# EAGLE design arduino-lockitron-nfc (EAGLE 7.5.0)
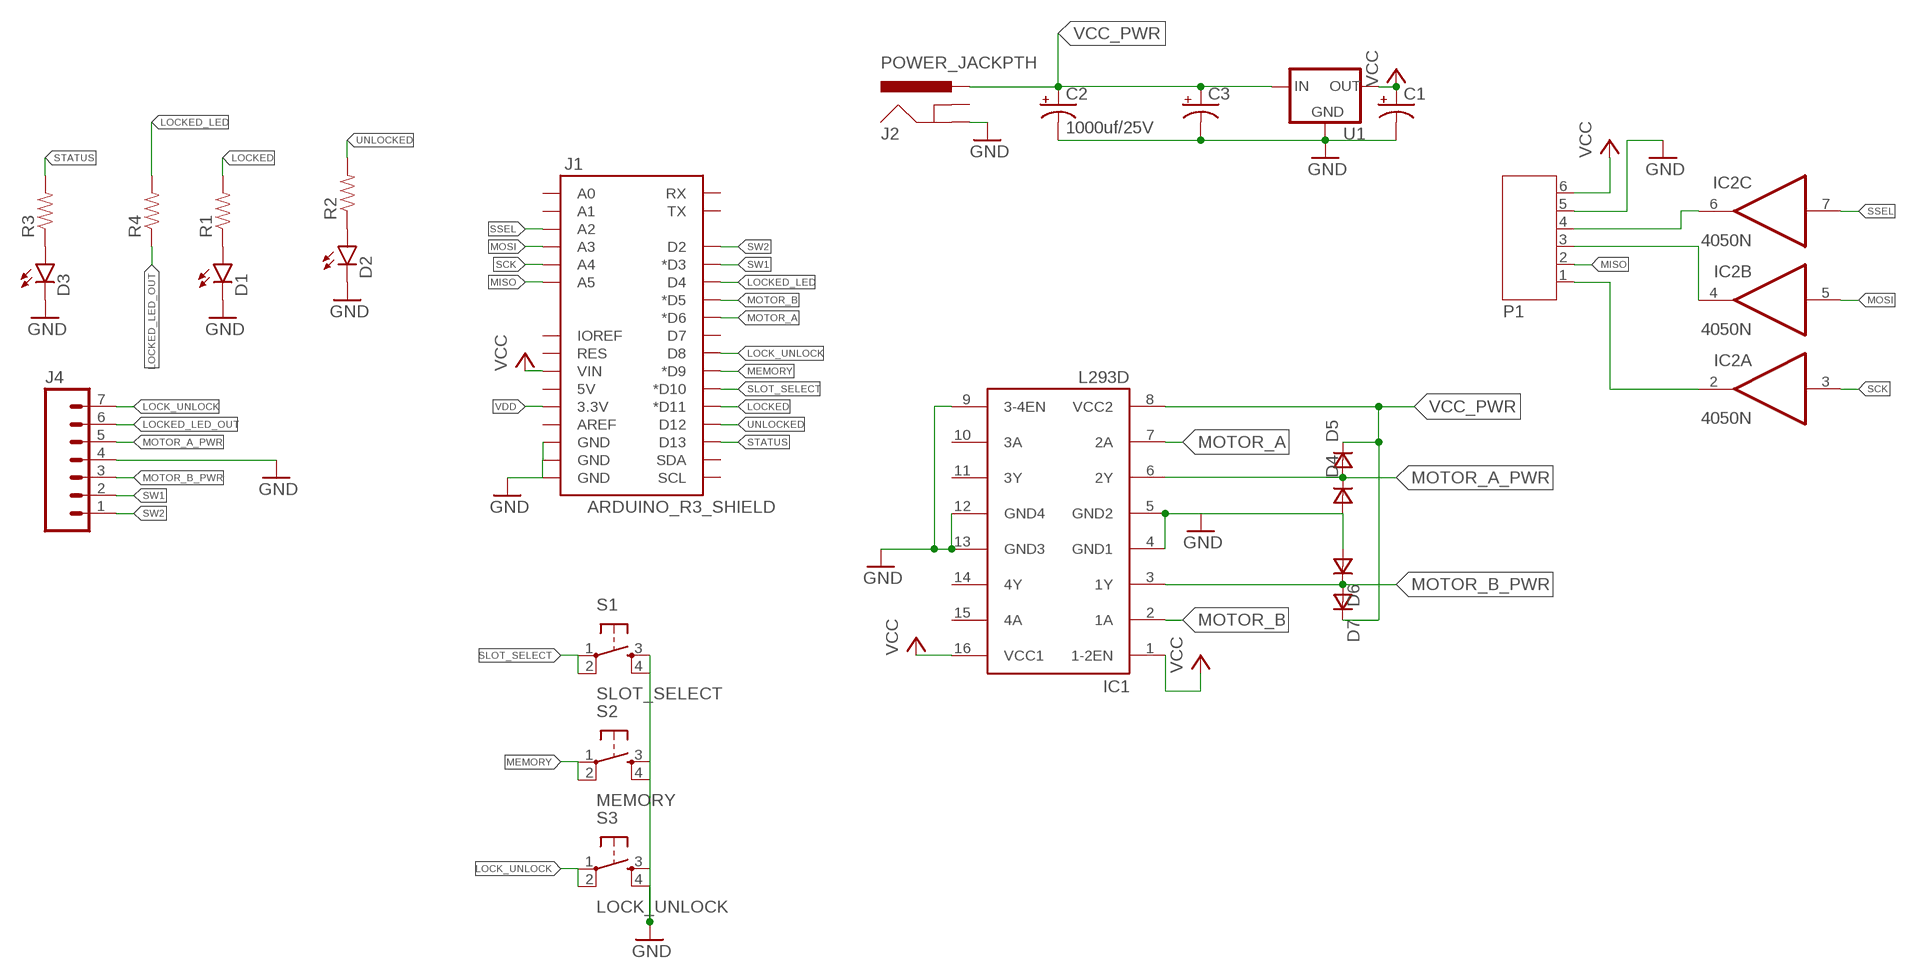
[diagram p0: schematic, sheet 1]

## Parts
C1  47UF-50V-20%(ELECT)  [PANASONIC_D]
C2  1000uf/25V  1000UF-25V(PTH)KIT  [CPOL-RADIAL-1000UF-25V-KIT]
C3  47UF-50V-20%(ELECT)  [PANASONIC_D]
D1  LED0603  [LED-0603]
D2  LED0603  [LED-0603]
D3  LED0603  [LED-0603]
D4  DSOD323  [SOD323]
D5  DSOD323  [SOD323]
D6  DSOD323  [SOD323]
D7  DSOD323  [SOD323]
IC1  L293D  [DIL16]
IC2  4050N  [DIL16]
J1  ARDUINO_R3_SHIELD  [UNO_R3_SHIELD]
J2  POWER_JACKPTH  [POWER_JACK_PTH]
J4  M07LONGPADS  [1X07_LONGPADS]
P1  JST-PH6  [JST-PH6]
R1  RESISTOR0603  [0603-RES]
R2  RESISTOR0603  [0603-RES]
R3  RESISTOR0603  [0603-RES]
R4  RESISTOR0603  [0603-RES]
S1  SLOT_SELECT  TAC_SWITCHSMD  [TACTILE-SWITCH-SMD]
S2  MEMORY  TAC_SWITCHSMD  [TACTILE-SWITCH-SMD]
S3  LOCK_UNLOCK  TAC_SWITCHSMD  [TACTILE-SWITCH-SMD]
U1  V_REG_78XXSIDE  [78XXL]

## Nets
LOCK_UNLOCK: J1.D8 J4.7 S3.1 S3.2
LOCKED: J1.D11(*D11) R1.2
LOCKED_LED: J1.D4 R4.2
LOCKED_LED_OUT: J4.6 R4.1
MEMORY: J1.D9(*D9) S2.1 S2.2
MISO: J1.A5 P1.2
MOSI: IC2.5(B:I) J1.A3
MOTOR_A: IC1.7(2A) J1.D6(*D6)
MOTOR_A_PWR: D4.1(C) D5.2(A) IC1.6(2Y) J4.5
MOTOR_B: IC1.2(1A) J1.D5(*D5)
MOTOR_B_PWR: D6.1(C) D7.2(A) IC1.3(1Y) J4.3
N$1: IC2.2(A:O) P1.1
N$2: IC2.4(B:O) P1.3
N$3: IC2.6(C:O) P1.4
N$4: D1.A R1.1
N$5: D3.A R3.1
N$6: D2.A R2.1
SCK: IC2.3(A:I) J1.A4
SLOT_SELECT: J1.D10(*D10) S1.1 S1.2
SSEL: IC2.7(C:I) J1.A2
STATUS: J1.D13 R3.2
SW1: J1.D3(*D3) J4.2
SW2: J1.D2 J4.1
UNLOCKED: J1.D12 R2.2
VCC: C1.+ IC1.1(1-2EN) IC1.16(VCC1) J1.VIN P1.6 U1.OUT
VCC_PWR: C2.+ C3.+ D5.1(C) D7.1(C) IC1.8(VCC2) J2.PWR U1.IN
VDD: J1.3.3V
VSS: C1.- C2.- C3.- D1.C D2.C D3.C D4.2(A) D6.2(A) IC1.4(GND1) IC1.5(GND2) IC1.9(3-4EN) IC1.12(GND4) IC1.13(GND3) J1.GND@0(GND) J1.GND@1(GND) J1.GND@2(GND) J2.GND J4.4 P1.5 S1.3 S1.4 S2.3 S2.4 S3.3 S3.4 U1.GND ; supply symbol labelled GND
Unconnected: IC1.10(3A) IC1.11(3Y) IC1.14(4Y) IC1.15(4A) IC2.9(D:I) IC2.10(D:O) IC2.11(E:I) IC2.12(E:O) IC2.14(F:I) IC2.15(F:O) J1.5V J1.A0 J1.A1 J1.AREF J1.D7 J1.IOREF J1.RES J1.RX J1.SCL J1.SDA J1.TX J2.GNDBREAK

## Power pins joined to a net without a drawn wire
VDD: IC2.1(P:VDD)
VSS: IC2.8(P:VSS)

## Library data of the parts
C1 C3 = SparkFun-Capacitors:47UF-50V-20%(ELECT): CAP-10547; PROD_ID: CAP-10547
C2 = SparkFun-Capacitors:1000UF-25V(PTH): CAP-08070; PROD_ID: CAP-09538
D1-D3 = SparkFun-LED:LED: LEDs Standard schematic elements and footprints for 5mm, 3mm, 1206, and 0603 sized LEDs. 5mm - Spark Fun Electronics SKU : COM-00529 (and others)
D4-D7 = zetex:D: DIODE; MPN: CDSOD323-T05C; OC_FARNELL: 1824860; OC_NEWARK: 79R6078
IC1 = st-microelectronics:L293D: PUSH-PULL 4 CHANNEL DRIVER; MPN: L293D; OC_FARNELL: 9589619; OC_NEWARK: 56P8249
IC2 = 40xx:4050: Hex non-inverting BUFFER
J1 = SparkFun-Boards:ARDUINO_R3_SHIELD: Shield form compatible with the Arduino Uno R3.
J2 = SparkFun-Connectors:POWER_JACK: Power Jack This is the standard 5.5mm barrel jack for power. The PTH is the most common, proven, reliable, footprint. The Slot footprint only works if the mill layer is transmitted to the PCB fab house so be warned. Mating wall wart : TOL-00298 (and others); PROD_ID: CONN-08197
J4 = SparkFun-Connectors:M07: Header 7 Standard 7-pin 0.1" header. Use with straight break away headers (SKU : PRT-00116), right angle break away headers (PRT-00553), swiss pins (PRT-00743), machine pins (PRT-00117), and female headers (PRT-00115). NOTES ON THE VARIANTS LOCK and LOCK_LONGPADS... This footprint was designed to help hold the alignment of a through-hole component (i.e. 7-pin header) while soldering it into place. You may notice that each hole has been shifted either up or down by 0.005 of an inch from it's more standard position (which is usually a perfectly straight line). This slight alteration caused the pins (the squares in the middle) to touch the edges of the holes. Because they are alternating, it causes a "brace" to hold the header in place. 0.005 has proven to be the perfect amount of "off-center" position when using our standard breakaway headers. Although looks a little odd when you look at the bare footprint, once you have a header in there, the alteration is very hard to notice. Also, if you push a header all the way into place, it is covered up entirely on the bottom side. This idea of altering the position of holes to aid alignment will be further integrated into the Sparkfun Library for other footprints. It can help hold any component with 3 or more connection pins.
P1 = jst-ph:JST-PH6
R1-R4 = SparkFun-Resistors:RESISTOR: Resistor Basic schematic elements and footprints for 0603, 1206, and PTH resistors.
S1-S3 = SparkFun-Retired:TAC_SWITCH: Momentary Switch Button commonly used for reset or general input. Spark Fun Electronics SKU : COM-00097 SMT- SWCH-08247; PROD_ID: SWCH-08247; VALUE: TAC_SWITCHSMD
U1 = SparkFun-PowerIC:V_REG_78XX: Voltage Regulator Standard 78xx regulator. IGO (Input Ground Output). Spark Fun Electronics SKU : COM-00107

## Board
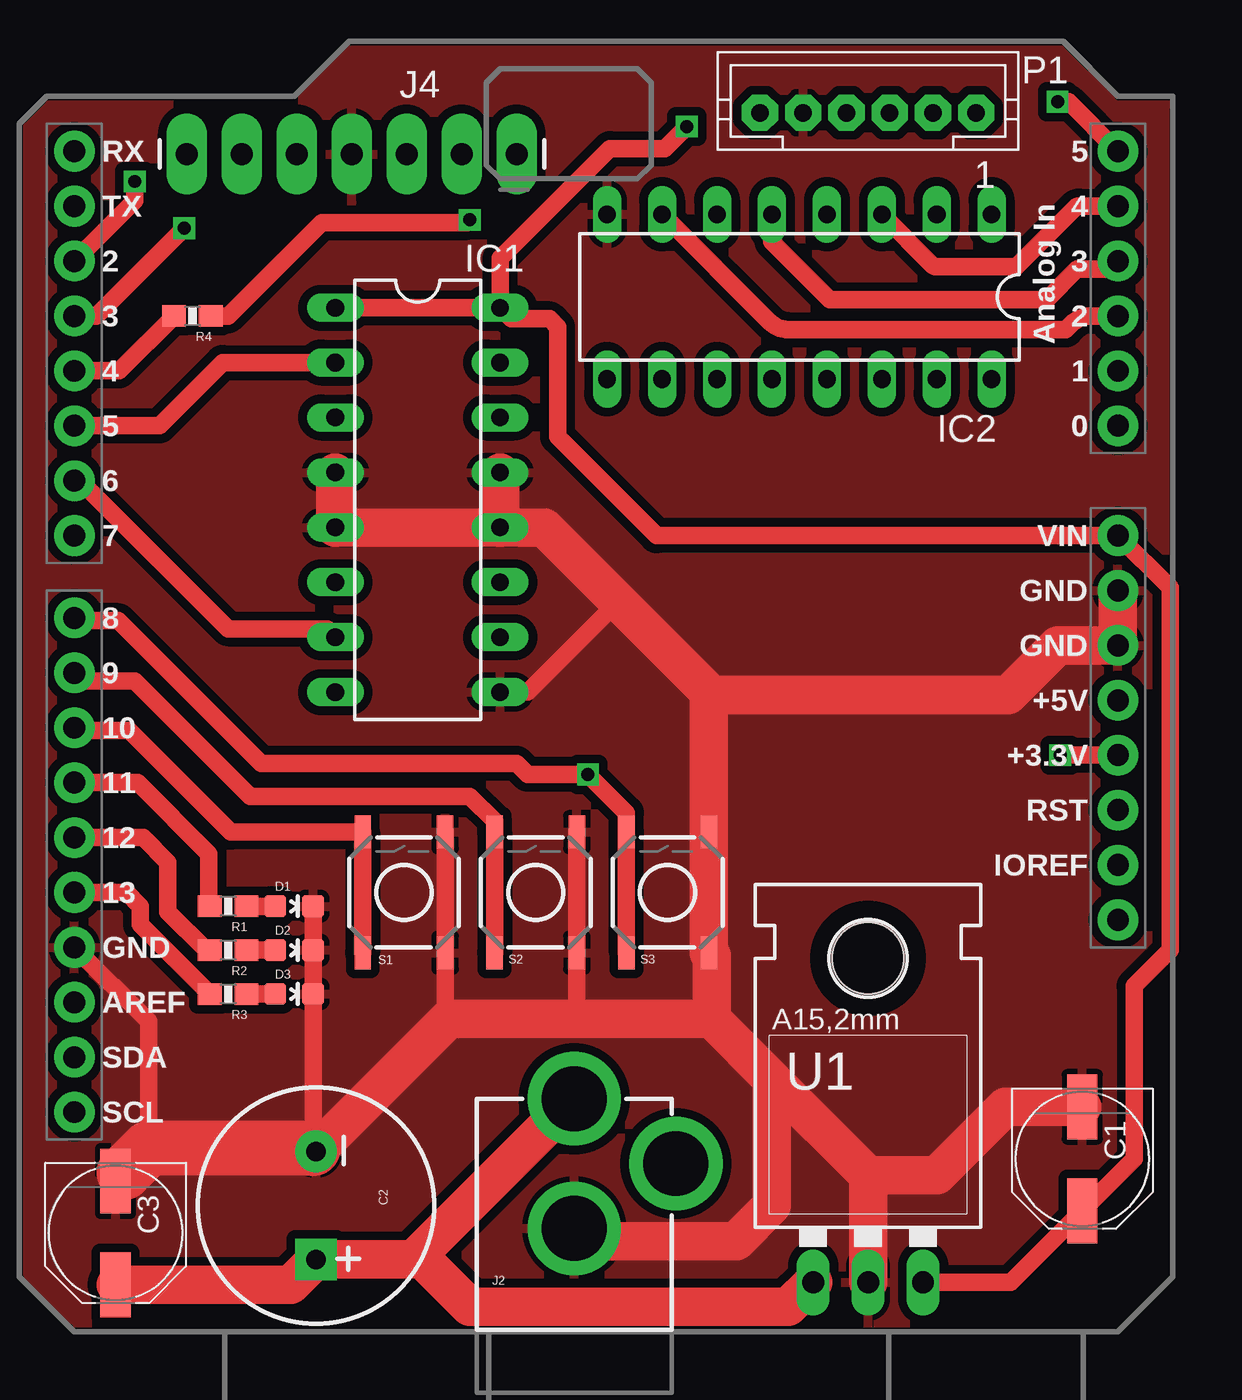
[diagram p1: board, top side]
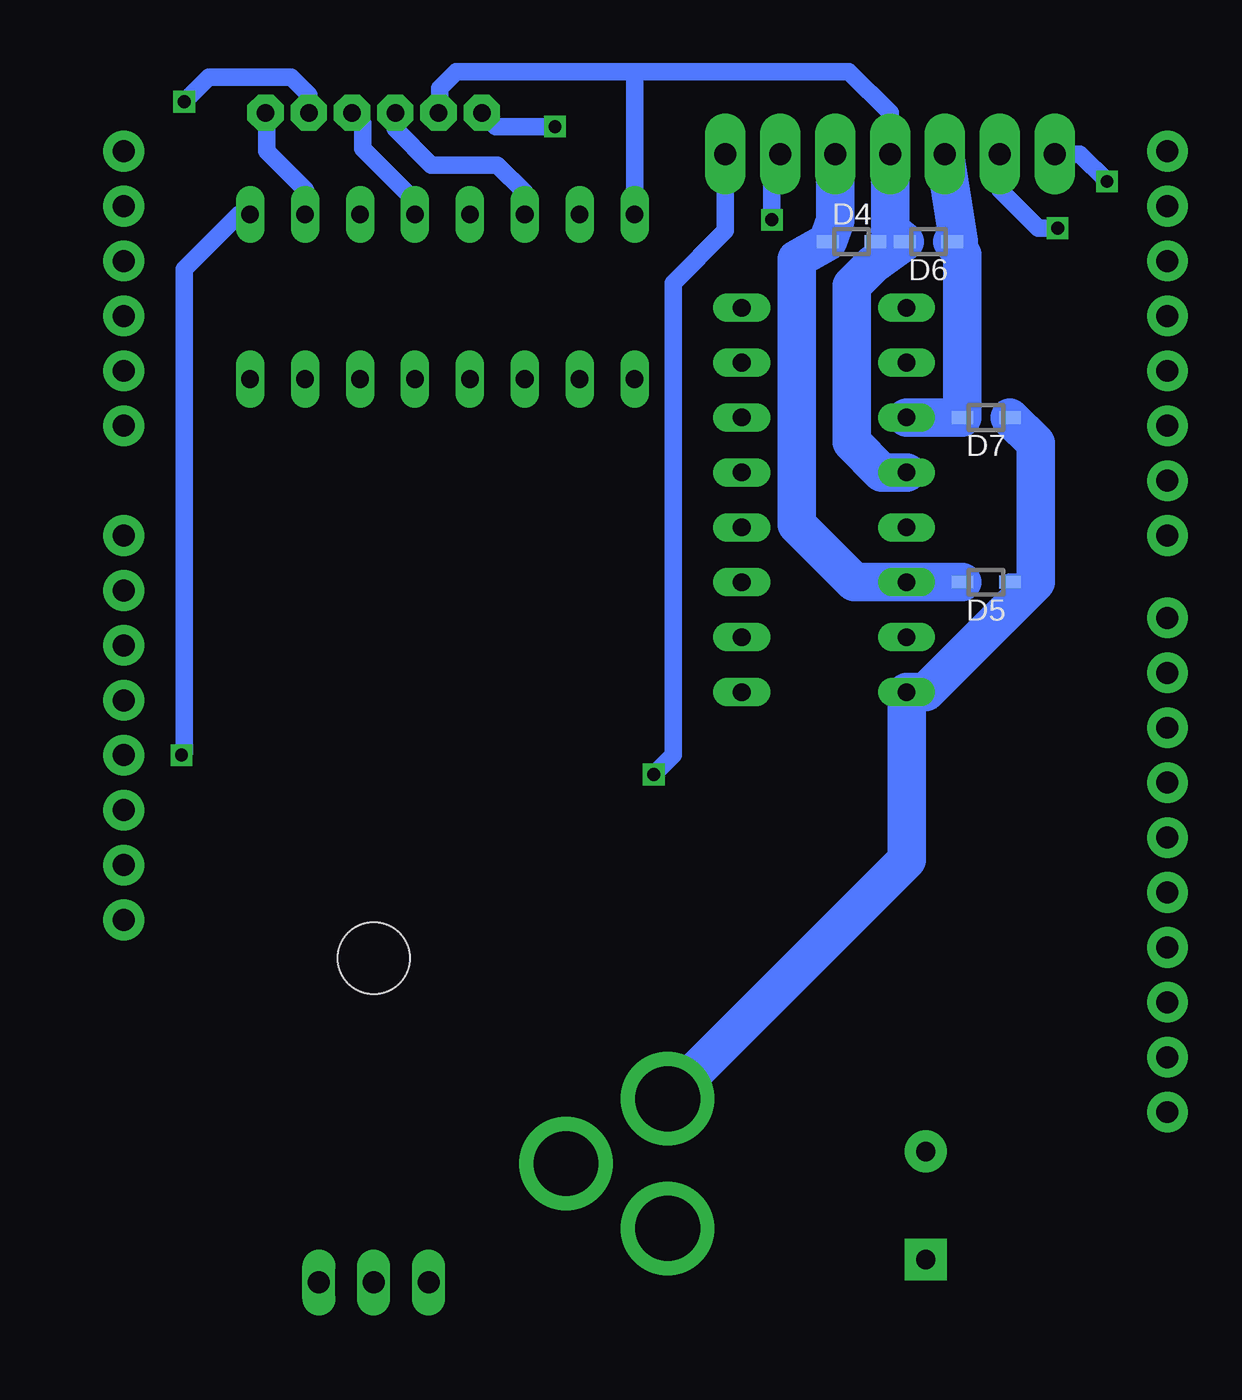
[diagram p2: board, bottom side, seen from below]

No outline drawn. Coordinates in mm, seen from the top.
Copper layers (1*16): Top 0.035mm / dielectric 1.5mm / Bottom 0.035mm
Design rules "default": minimum track width 10mil, minimum drill 24mil, track to track 8mil, track to pad 8mil, pad to pad 8mil, via to via 8mil, smd to smd 8mil, copper to edge 40mil, drill to drill 8mil, minimum pad ring 10mil, minimum via ring 8mil, stop-mask expansion 4mil, vias tented up to drill 0mil, thermal gap 10mil

### Footprints (pad centres in the part's own frame; a part is rotated, then mirrored left to right if it is on the bottom)
PANASONIC_D = smd 3 x 1.4: + 2.4,0; - -2.4,0
CPOL-RADIAL-1000UF-25V-KIT = drill 0.9 pad 1.93 square: + 2.5,0 | drill 0.9 pad 1.93: - -2.5,0
LED-0603 = smd 1 x 1: A 0,-0.877; C 0,0.877
SOD323 = smd 1 x 0.6: 1 -1.1,0; 2 1.1,0
DIL16 = drill 0.813 long: 1 -8.89,-3.81; 2 -6.35,-3.81; 3 -3.81,-3.81; 4 -1.27,-3.81; 5 1.27,-3.81; 6 3.81,-3.81; 7 6.35,-3.81; 8 8.89,-3.81; 9 8.89,3.81; 10 6.35,3.81; 11 3.81,3.81; 12 1.27,3.81; 13 -1.27,3.81; 14 -3.81,3.81; 15 -6.35,3.81; 16 -8.89,3.81
UNO_R3_SHIELD = drill 1.016 pad 1.88: 3.3V 50.8,26.67; 5V 50.8,29.21; A0 50.8,41.91; A1 50.8,44.45; A2 50.8,46.99; A3 50.8,49.53; A4 50.8,52.07; A5 50.8,54.61; AREF 2.54,15.24; D2 2.54,49.53; D3 2.54,46.99; D4 2.54,44.45; D5 2.54,41.91; D6 2.54,39.37; D7 2.54,36.83; D8 2.54,33.02; D9 2.54,30.48; D10 2.54,27.94; D11 2.54,25.4; D12 2.54,22.86; D13 2.54,20.32; GND@0 50.8,31.75; GND@1 50.8,34.29; GND@2 2.54,17.78; IOREF 50.8,21.59; NC 50.8,19.05; RES 50.8,24.13; RX 2.54,54.61; SCL 2.54,10.16; SDA 2.54,12.7; TX 2.54,52.07; VIN 50.8,36.83
POWER_JACK_PTH = drill 2.997 pad 4.318: GND 0,7.7; GNDBREAK 4.7,10.7; PWR 0,13.7
1X07_LONGPADS = drill 1.016 pad 1.88 long: 1 0,0; 2 2.54,0; 3 5.08,0; 4 7.62,0; 5 10.16,0; 6 12.7,0; 7 15.24,0
JST-PH6 = drill 0.813 pad 1.676 octagon: 1 5,0; 2 3,0; 3 1,0; 4 -1,0; 5 -3,0; 6 -5,0
0603-RES = smd 1.1 x 1: 1 -0.85,0; 2 0.85,0
TACTILE-SWITCH-SMD = smd 1.524 x 0.762: 1 -2.794,1.905; 2 2.794,1.905; 3 -2.794,-1.905; 4 2.794,-1.905
78XXL = drill 1.016 long: GND 0,-3.81; IN -2.54,-3.81; OUT 2.54,-3.81 | hole 3.302: 0,11.176

### Placement (x,y rotation side)
C1  49.15,8 270 top
C2  13.72,5.84 270 top
C3  4.45,4.57 270 top
D1  12.7,19.68 270 top
D2  12.7,17.65 270 top
D3  12.7,15.62 270 top
D4  17.14,50.42 0 bottom
D5  10.92,34.67 180 bottom
D6  13.59,50.42 180 bottom
D7  10.92,42.29 180 bottom
IC1  18.41,38.48 270 top
IC2  36.07,47.88 180 top
J1  0,0 0 top
J2  25.65,-2.92 0 top
J4  7.75,54.48 0 top
P1  39.24,56.39 0 top
R1  9.65,19.68 180 top
R2  9.65,17.65 180 top
R3  9.65,15.62 180 top
R4  8,46.99 180 top
S1  17.78,20.32 90 top
S2  23.88,20.32 90 top
S3  29.97,20.32 90 top
U1  39.24,6.1 0 top

### Tracks (layer width: path | path; a pad name or v marks a point on that pad's centre or on a via)
LOCK_UNLOCK  (via drill 0.6)
  Top 0.813: J1.D8 2.67,32.89 4.57,32.89 11.18,26.29 22.99,26.29 23.5,25.78 v26.29,25.78 28.07,24 S3.2 S3.1
  Bottom 0.813: J4.7 22.99,50.93 25.4,48.51 25.4,26.67 v26.29,25.78
LOCKED
  Top 0.813: J1.D11 5.46,25.4 8.76,22.1 8.76,19.72 R1.2
LOCKED_LED
  Top 0.813: J1.D4 4.61,44.45 R4.2
LOCKED_LED_OUT  (via drill 0.6)
  Top 0.813: R4.1 9.65,46.99 13.97,51.31 20.7,51.31 v20.83,51.44
  Bottom 0.813: v20.83,51.44 20.83,54.1 J4.6
MEMORY
  Top 0.813: J1.D9 2.92,30.1 5.33,30.1 10.67,24.77 20.83,24.77 21.97,23.62 S2.2 S2.1
MISO  (via drill 0.6)
  Top 0.813: v48.01,56.9 48.51,56.9 J1.A5
  Bottom 0.813: P1.2 42.24,57.23 43.05,58.04 46.86,58.04 v48.01,56.9
MOSI
  Top 0.813: IC2.5 34.8,50.42 37.47,47.75 47.5,47.75 48.9,49.15 50.42,49.15 J1.A3
MOTOR_A
  Top 0.813: J1.D6 2.79,39.37 9.65,32.51 14.22,32.51 IC1.7
MOTOR_A_PWR
  Bottom 1.778: D5.2 IC1.6 17.02,34.67 19.68,37.34 19.68,49.61 D4.1 17.91,51.39 J4.5
MOTOR_B
  Top 0.813: J1.D5 6.48,41.91 9.4,44.83 IC1.2
MOTOR_B_PWR
  Bottom 0.813: 12.19,50.38 D6.1
  Bottom 1.778: IC1.3 D7.2 12.02,49.83 D6.1 | 12.19,50.38 J4.3
N$1
  Bottom 0.813: IC2.2 42.42,52.83 44.2,54.61 44.2,56.34 P1.1
N$2
  Bottom 0.813: IC2.4 37.34,52.32 39.75,54.74 39.75,55.9 P1.3
N$3
  Bottom 0.813: P1.4 38.24,55.64 36.58,53.98 33.53,53.98 32.26,52.7 IC2.6
N$4
  Top 0.813: D1.A R1.1
N$5
  Top 0.813: D3.A R3.1
N$6
  Top 0.813: R2.1 D2.A
SCK
  Top 0.813: IC2.3 42.22,49.35 arc45 42.4,49.28 46.1,49.28 48.82,52 arc-45 49,52.07 J1.A4
SLOT_SELECT
  Top 0.813: J1.D10 2.67,27.81 5.08,27.81 9.78,23.11 S1.2 S1.1
SSEL
  Top 0.813: IC2.7 34.68,46.73 arc45 35.58,46.35 48.39,46.35 48.65,46.62 arc-45 49.55,46.99 J1.A2
STATUS
  Top 0.813: J1.D13 4.95,20.32 5.59,19.68 5.59,18.84 R3.2
SW1  (via drill 0.6)
  Top 0.813: J1.D3 3.56,46.99 v7.62,51.05
  Bottom 0.813: v7.62,51.05 8.51,51.05 10.29,52.83 J4.2
SW2  (via drill 0.6)
  Top 0.813: J1.D2 5.33,52.32 v5.33,53.21
  Bottom 0.813: v5.33,53.21 6.6,54.48 J4.1
UNLOCKED
  Top 0.813: R2.2 8.64,17.65 6.86,19.43 6.86,21.72 5.71,22.86 J1.D12
VCC  (via drill 0.6)
  Top 0.813: U1.OUT 45.83,2.29 C1.+ 51.55,8 51.55,15.99 53.21,17.65 53.21,34.42 J1.VIN 29.46,36.83 24.89,41.4 24.89,46.48 24.51,46.86 22.73,46.86 IC1.16 | IC1.1 IC1.16 | IC1.16 22.23,49.66 27.3,54.74 29.84,54.74 v30.86,55.75
  Bottom 0.813: v30.86,55.75 33.61,55.75 P1.6
VCC_PWR
  Top 1.778: C3.+ 12.55,2.17 C2.+ 18.22,3.34 18.55,3.67 | 18.55,3.67 J2.PWR | U1.IN 35.56,1.14 20.83,1.14 18.55,3.42 18.55,3.67
  Bottom 0.813: D5.1 9.27,34.67 8.95,34.35
  Bottom 1.778: J2.PWR 14.61,21.83 IC1.8 13.72,29.59 8.95,34.35 8.64,34.67 8.64,41.1 D7.1
VDD  (via drill 0.6)
  Top 0.813: v48.13,26.67 J1.3.3V
  Bottom 0.813: IC2.1 45.47,51.69 48.01,49.15 48.01,26.8 v48.13,26.67
VSS
  Top 0.813: S2.4 S2.3 25.78,14.61 25.91,14.48 | J1.GND@2 5.97,14.35 5.97,8.5 4.83,7.36 C3.- | D1.C D2.C D3.C 13.58,8.48 C2.- | 20.07,14.48 19.68,14.86 S1.3 S1.4 | IC1.9 23.5,29.59 27.69,33.78
  Top 1.778: U1.GND 39.24,7.24 | 39.24,7.24 34.8,11.68 | 34.8,11.68 32,14.48 | 32,14.48 25.91,14.48 20.07,14.48 19.85,14.48 C2.- | 39.24,7.24 42.42,7.24 45.59,10.41 49.14,10.41 C1.- | IC1.12 24.26,37.21 27.69,33.78 32,29.46 32.13,29.46 | IC1.13 IC1.12 | IC1.12 IC1.5 IC1.4 | 32.13,29.46 45.72,29.46 48.01,31.75 J1.GND@0 J1.GND@1 | J2.GND 26.24,4.19 33.15,4.19 34.8,5.84 34.8,11.68 | 32,14.48 32,17.4 S3.3 S3.4 31.88,29.21 32.13,29.46
  Top 2.54: 13.58,8.48 5.95,8.48 4.83,7.36
  Bottom 0.813: P1.5 36.2,56.44 36.2,57.53 35.43,58.29 27.18,58.29 | 27.18,58.29 17.27,58.29 15.37,56.39 J4.4 | D4.2 D6.2 | IC2.8 27.18,58.29
  Bottom 1.778: IC1.4 15.75,39.75 17.14,41.15 17.14,48.39 16.13,49.4 16.09,49.4 D6.2 15.37,50.97 J4.4
  pour Top (isolate 0.406): 2.79,0.51 2.54,0.51 0.38,2.67 0.38,55.75 1.4,56.77 12.83,56.77 15.37,59.31 48.13,59.31 50.16,57.28 50.67,56.77 53.09,56.77 52.96,56.64 52.96,2.67 50.67,0.38 2.67,0.38